# Altium schematic sheet 33.SchDoc
size 513 x 386 mm
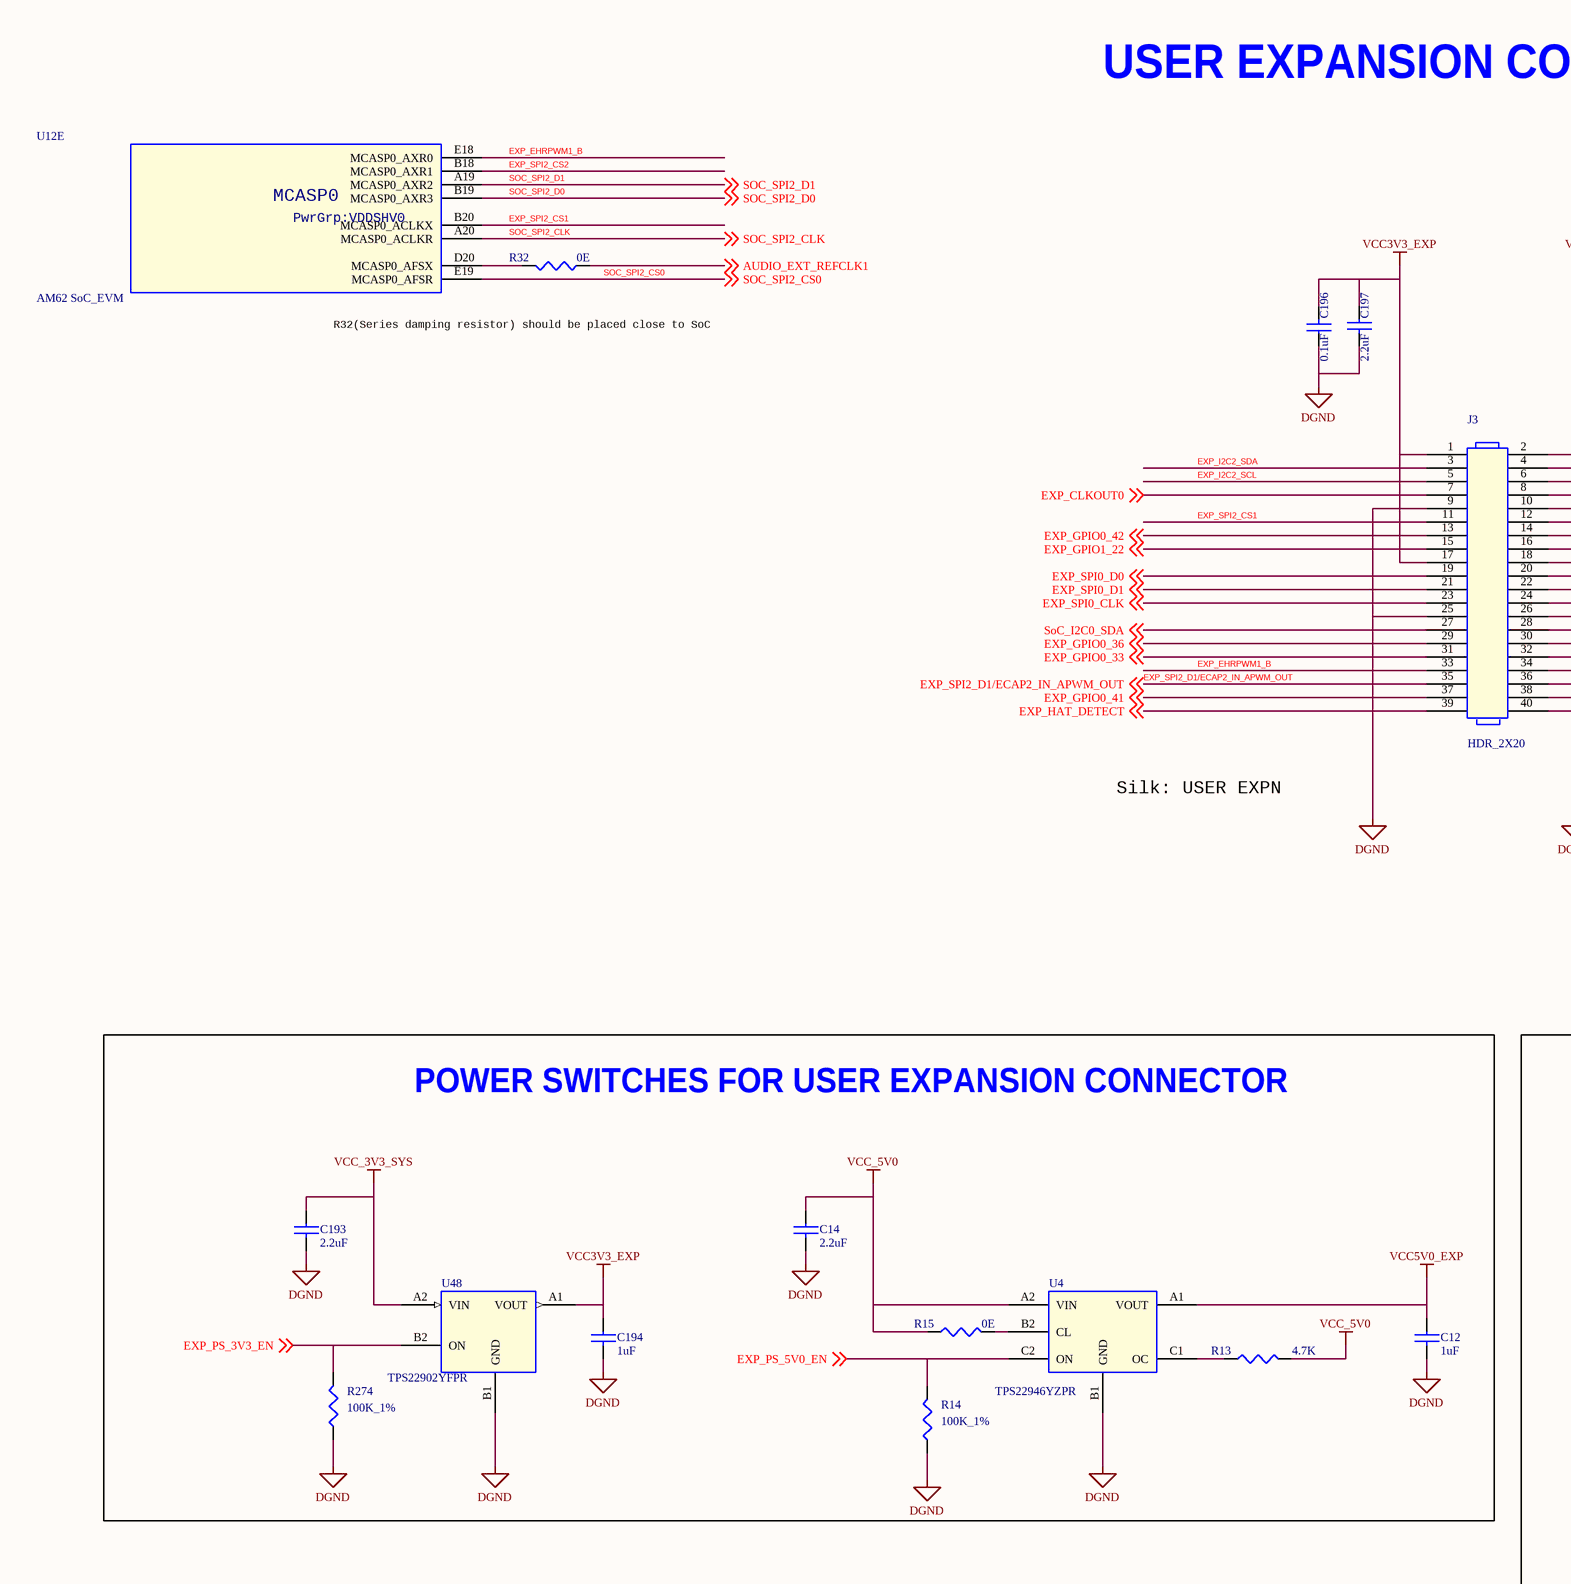
[diagram p0: 33.SchDoc, top left]
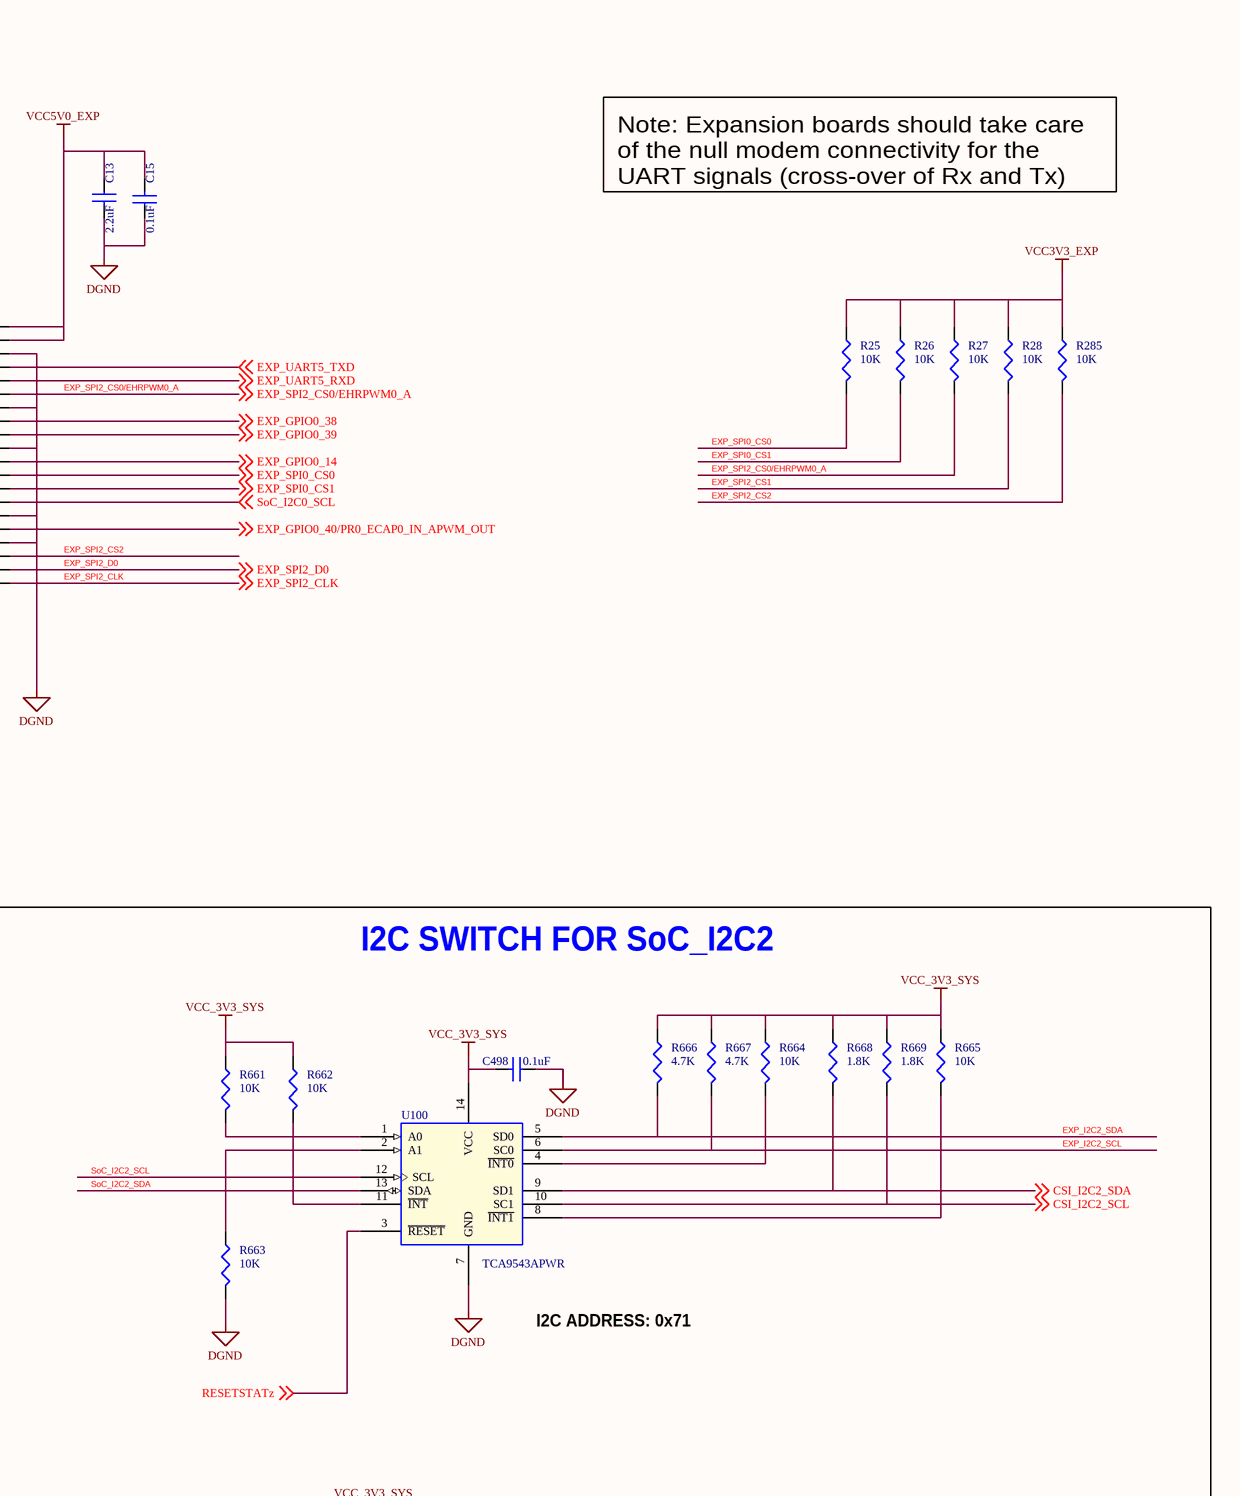
[diagram p1: 33.SchDoc, top right]
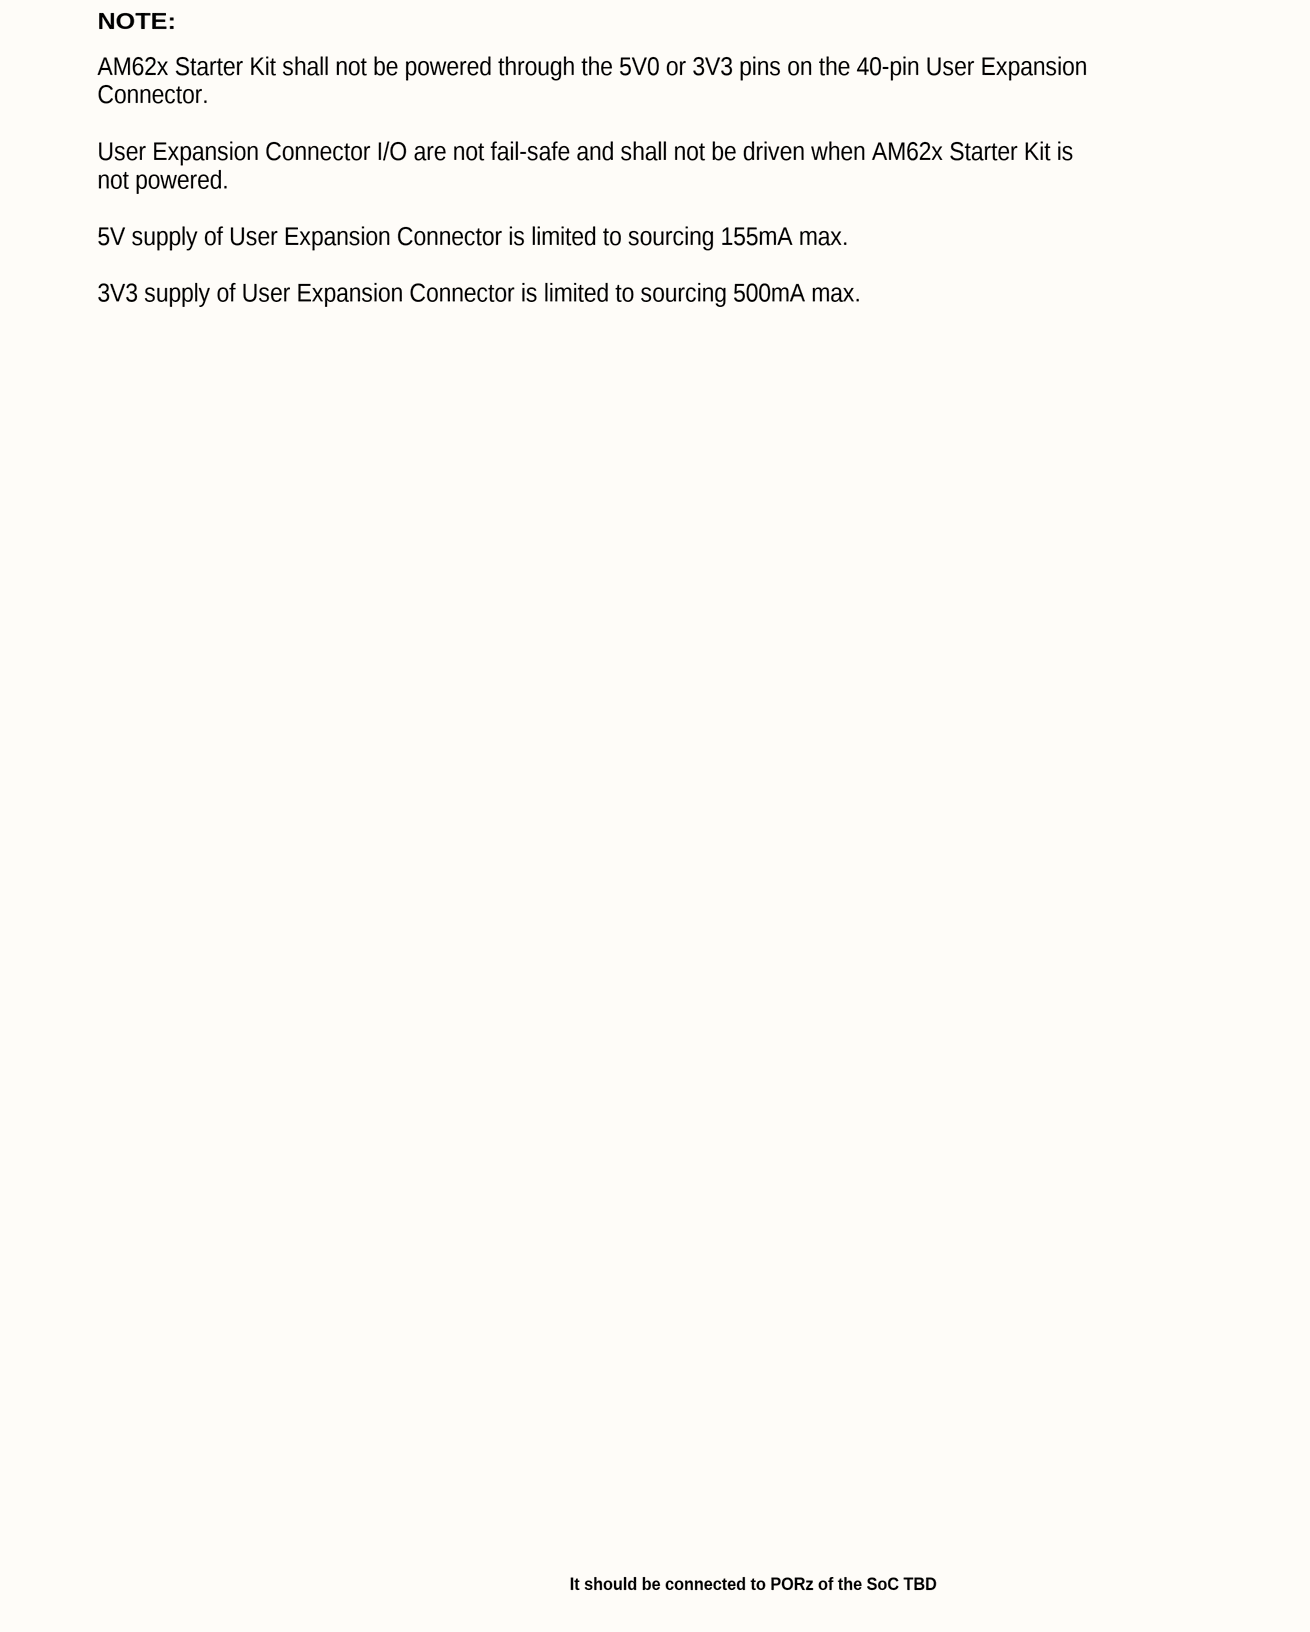
[diagram p2: 33.SchDoc, bottom left]
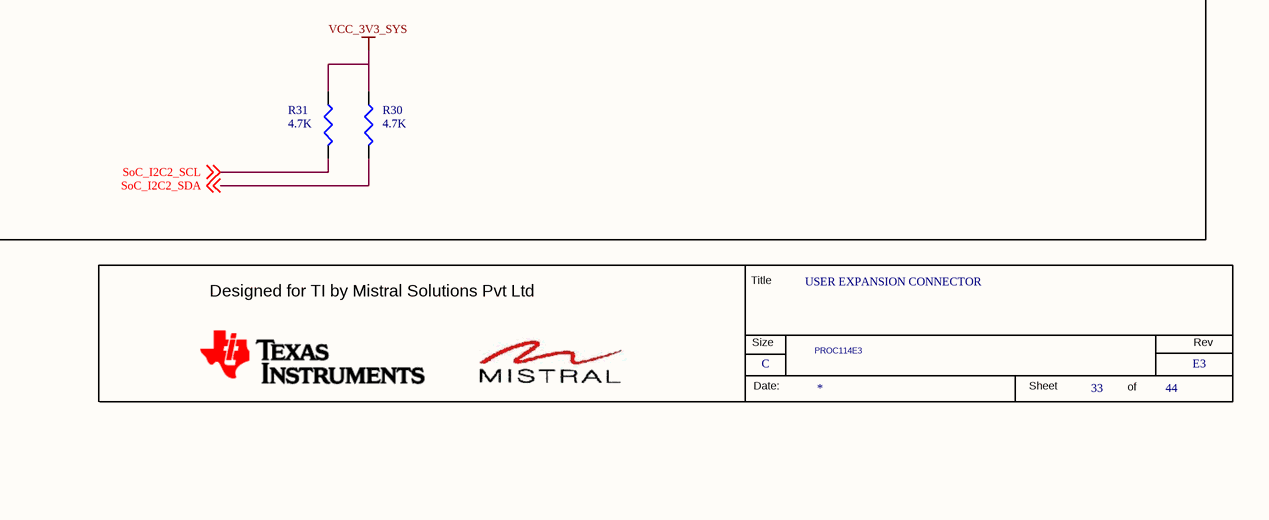
[diagram p3: 33.SchDoc, bottom right]

## Parts
*  RevCode: E3  Title: USER EXPANSION CONNECTOR  Page Size: C  Page Number: 33  Page Count: 44  Variant Name: PROC114E3  (hidden comment: MISTRAL_TITLEBLK_CSIZE)  (graphical)
C12  1uF  [CAP0201_0-5]
C13  2.2uF  [CAP0402_0-75]
C14  2.2uF  [CAP0402_0-75]
C15  0.1uF  [CAP0402_0-75]
C193  2.2uF  [CAP0402_0-75]
C194  1uF  [CAP0201_0-5]
C196  0.1uF  [CAP0402_0-75]
C197  2.2uF  [CAP0402_0-75]
C498  0.1uF  [CAP0402_0-75]
J3  HDR_2X20  [HDR_2X20_PEC20DAAN_S_T_8-6]
R13  4.7K  [RES0201_0-5]
R14  100K_1%  [RES0201_0-5]
R15  0E  [RES0201_0-5]
R25  10K  [RES0201_0-5]
R26  10K  [RES0201_0-5]
R27  10K  [RES0201_0-5]
R28  10K  [RES0201_0-5]
R30  4.7K  [RES0201_0-5]
R31  4.7K  [RES0201_0-5]
R32  0E  [RES0201_0-5]
R274  100K_1%  [RES0201_0-5]
R285  10K  [RES0201_0-5]
R661  10K  [RES0201_0-5]
R662  10K  [RES0201_0-5]
R663  10K  [RES0201_0-5]
R664  10K  [RES0201_0-5]
R665  10K  [RES0201_0-5]
R666  4.7K  [RES0201_0-5]
R667  4.7K  [RES0201_0-5]
R668  1.8K  [RES0201_0-5]
R669  1.8K  [RES0201_0-5]
U4  TPS22946YZPR  [DSBGA6_19-68_40X60_0-5]
U12  AM62 SoC_EVM  [BGA425_19-68_510X510_0-7]  (part E of 18)
U48  TPS22902YFPR  [DSBGA4_15-74_30X30_0-5]
U100  TCA9543APWR  [TSSOP14_25-59_205X180_1-2]

## Blocks framed on the sheet
POWER SWITCHES FOR USER EXPANSION CONNECTOR: C12 C14 C193 C194 R13-R15 R274 U4 U48
I2C SWITCH FOR SoC_I2C2: C498 R30 R31 R661-R669 U100

## Nets
DGND: C12.2 C13.2 C14.2 C15.1 C193.2 C194.2 C196.1 C197.2 C498.1 J3.6 J3.9 J3.14 J3.20 J3.25 J3.30 J3.34 R14.1 R274.1 R663.2 U4.B1(GND) U48.B1(GND) U100.7(GND)
VCC3V3_EXP: C194.1 C196.2 C197.1 J3.1 J3.17 R25.1 R26.1 R27.1 R28.1 R285.1 U48.A1(VOUT)
VCC5V0_EXP: C12.1 C13.1 C15.2 J3.2 J3.4 U4.A1(VOUT)
VCC_3V3_SYS: C193.1 C498.2 R30.1 R31.1 R661.1 R662.1 R664.1 R665.1 R666.1 R667.1 R668.1 R669.1 U48.A2(VIN) U100.14(VCC)
VCC_5V0: C14.1 R13.2 R15.1 U4.A2(VIN)
AUDIO_EXT_REFCLK1: R32.1 ; off-sheet AUDIO_EXT_REFCLK1
CSI_I2C2_SCL: R669.2 U100.10(SC1) ; off-sheet CSI_I2C2_SCL
CSI_I2C2_SDA: R668.2 U100.9(SD1) ; off-sheet CSI_I2C2_SDA
EXP_CLKOUT0: J3.7 ; off-sheet EXP_CLKOUT0
EXP_EHRPWM1_B: J3.33 U12.E18(MCASP0_AXR0)
EXP_GPIO0_14: J3.22 ; off-sheet EXP_GPIO0_14
EXP_GPIO0_33: J3.31 ; off-sheet EXP_GPIO0_33
EXP_GPIO0_36: J3.29 ; off-sheet EXP_GPIO0_36
EXP_GPIO0_38: J3.16 ; off-sheet EXP_GPIO0_38
EXP_GPIO0_39: J3.18 ; off-sheet EXP_GPIO0_39
EXP_GPIO0_40/PR0_ECAP0_IN_APWM_OUT: J3.32 ; off-sheet EXP_GPIO0_40/PR0_ECAP0_IN_APWM_OUT
EXP_GPIO0_41: J3.37 ; off-sheet EXP_GPIO0_41
EXP_GPIO0_42: J3.13 ; off-sheet EXP_GPIO0_42
EXP_GPIO1_22: J3.15 ; off-sheet EXP_GPIO1_22
EXP_HAT_DETECT: J3.39 ; off-sheet EXP_HAT_DETECT
EXP_I2C2_SCL: J3.5 R667.2 U100.6(SC0)
EXP_I2C2_SDA: J3.3 R666.2 U100.5(SD0)
EXP_PS_3V3_EN: R274.2 U48.B2(ON) ; off-sheet EXP_PS_3V3_EN
EXP_PS_5V0_EN: R14.2 U4.C2(ON) ; off-sheet EXP_PS_5V0_EN
EXP_SPI0_CLK: J3.23 ; off-sheet EXP_SPI0_CLK
EXP_SPI0_CS0: J3.24 R25.2 ; off-sheet EXP_SPI0_CS0
EXP_SPI0_CS1: J3.26 R26.2 ; off-sheet EXP_SPI0_CS1
EXP_SPI0_D0: J3.19 ; off-sheet EXP_SPI0_D0
EXP_SPI0_D1: J3.21 ; off-sheet EXP_SPI0_D1
EXP_SPI2_CLK: J3.40 ; off-sheet EXP_SPI2_CLK
EXP_SPI2_CS0/EHRPWM0_A: J3.12 R27.2 ; off-sheet EXP_SPI2_CS0/EHRPWM0_A
EXP_SPI2_CS1: J3.11 R28.2 U12.B20(MCASP0_ACLKX)
EXP_SPI2_CS2: J3.36 R285.2 U12.B18(MCASP0_AXR1)
EXP_SPI2_D0: J3.38 ; off-sheet EXP_SPI2_D0
EXP_SPI2_D1/ECAP2_IN_APWM_OUT: J3.35 ; off-sheet EXP_SPI2_D1/ECAP2_IN_APWM_OUT
EXP_UART5_RXD: J3.10 ; off-sheet EXP_UART5_RXD
EXP_UART5_TXD: J3.8 ; off-sheet EXP_UART5_TXD
RESETSTATz: U100.3(~{RESET}) ; off-sheet RESETSTATz
SoC_I2C0_SCL: J3.28 ; off-sheet SoC_I2C0_SCL
SoC_I2C0_SDA: J3.27 ; off-sheet SoC_I2C0_SDA
SoC_I2C2_SCL: R31.2 U100.12(SCL) ; off-sheet SoC_I2C2_SCL
SoC_I2C2_SDA: R30.2 U100.13(SDA) ; off-sheet SoC_I2C2_SDA
SOC_SPI2_CLK: U12.A20(MCASP0_ACLKR) ; off-sheet SOC_SPI2_CLK
SOC_SPI2_CS0: U12.E19(MCASP0_AFSR) ; off-sheet SOC_SPI2_CS0
SOC_SPI2_D0: U12.B19(MCASP0_AXR3) ; off-sheet SOC_SPI2_D0
SOC_SPI2_D1: U12.A19(MCASP0_AXR2) ; off-sheet SOC_SPI2_D1
NetR13_1: R13.1 U4.C1(OC)
NetR15_2: R15.2 U4.B2(CL)
NetR32_2: R32.2 U12.D20(MCASP0_AFSX)
NetR661_2: R661.2 U100.1(A0)
NetR662_2: R662.2 U100.11(~{INT})
NetR663_1: R663.1 U100.2(A1)
NetR664_2: R664.2 U100.4(~{INT0})
NetR665_2: R665.2 U100.8(~{INT1})

## Notes on the sheet
- USER EXPANSION CONNECTOR
- Note: Expansion boards should take care
  of the null modem connectivity for the
  UART signals (cross-over of Rx and Tx)
- R32(Series damping resistor) should be placed close to SoC
- Silk: USER EXPN
- I2C ADDRESS: 0x71
- NOTE:
- AM62x Starter Kit shall not be powered through the 5V0 or 3V3 pins on the 40-pin User Expansion
  Connector.
  User Expansion Connector I/O are not fail-safe and shall not be driven when AM62x Starter Kit is
  not powered.
  5V supply of User Expansion Connector is limited to sourcing 155mA max.
  3V3 supply of User Expansion Connector is limited to sourcing 500mA max.
- It should be connected to PORz of the SoC TBD
- (in symbol AM62-EVM_BGA425, part E) MCASP0; PwrGrp:VDDSHV0
- (in symbol MISTRAL_TITLEBLK_CSIZE) Title; Designed for TI by Mistral Solutions Pvt Ltd; Size; Rev; Date:; Sheet; of

## Library data of the parts
* = MISTRAL_TITLEBLK_CSIZE: Issue: 1.0; Page Create Date: March  8, 1995; Page Modify Date: *; Schematic Page Count: 44; Schematic Page Number: 33
C12 = CAP_Dup2: CAP CERAMIC 1uF 16V 20% X5R 0201; Mistral Part No: 120018090038-R; Mfr_name: MURATA; Mfr_part_number: GRM033R61C105ME15D; Part_type: CAPACITORS\CERAMIC; Project: QCS610_NANOSOM; Wattage: NA; Customs_HS_Code: 85322990; Custom_Duty: 15%; PCB Footprint: CAP0201_0-5; Library Ref: CAP; MECHANICAL 3D STEP FILE: CAP0201_0-5; Tolerance: 20%; Voltage: 16V; Package: 0201; Distributor_name: DIGIKEY; Distributor_part_number: 490-18654-1-ND; Height: 0.39MM; Weight: 0.33mg; Temperature: -55°C+85°C; Datasheet: Y:\MIS_DATABASE\DATASHEETS\CAPACITORS\GRM033R61C105ME15.PDF; Crtd /date: ALVY/260520; Chkd/date: MANIRAJA/300520; Footprint Ref: CAP0201_0-5; Library Path: Y:\MIS_DATABASE\Library\ALTIUM_TOOL\SCHEMATICS_PARTS\MS_DISCRETE_Library.schlib; Footprint Path: Y:\MIS_DATABASE\Library\ALTIUM_TOOL\PCB_FOOTPRINTS\Altium_Footprint_Lib.PcbLib
C13 C197 = CAP: CAP CERAMIC 2.2uF 25V 10% X5R 0402; Mistral Part No: 120015120001-R; Mfr_name: MURATA; Mfr_part_number: GRM155R61E225KE11D; Part_type: CAPACITORS\CERAMIC; Project: TI_AM263X_CC; Wattage: NA; Customs_HS_Code: 85322990; Custom_Duty: 15%; PCB Footprint: CAP0402_0-75; Footprint Ref: CAP0402_0-75; Tolerance: 10%; Voltage: 25V; Package: 0402; Distributor_name: DIGIKEY; Distributor_part_number: 490-12703-1-ND; Library Ref: CAP; Height: 0.70MM; Weight: 1.5mg; Temperature: -55°C+85°C; Datasheet: Y:\MIS_DATABASE\DATASHEETS\CAPACITORS\GRM155R61E225KE11.PDF; Crtd /date: MANIRAJA/010721; Chkd/date: ALVY/010721; MECHANICAL 3D STEP FILE: CAP0402_0-75; Library Path: Y:\MIS_DATABASE\Library\ALTIUM_TOOL\SCHEMATICS_PARTS\MS_DISCRETE_Library.schlib; Footprint Path: Y:\MIS_DATABASE\Library\ALTIUM_TOOL\PCB_FOOTPRINTS\Altium_Footprint_Lib.PcbLib
C14 C193 = CAP: CAP CERAMIC 2.2uF 25V 10% X5R 0402; Part_type: CAPACITORS\CERAMIC; Mfr_part_number: GRM155R61E225KE11D; Mfr_name: MURATA; Mistral Part No: 120015120001-R; Custom_Duty: 15%; Customs_HS_Code: 85322990; Wattage: NA; Project: TI_AM263X_CC; PCB Footprint: CAP0402_0-75; Footprint Path: Y:\MIS_DATABASE\Library\ALTIUM_TOOL\PCB_FOOTPRINTS\Altium_Footprint_Lib.PcbLib; Library Path: Y:\MIS_DATABASE\Library\ALTIUM_TOOL\SCHEMATICS_PARTS\MS_DISCRETE_Library.schlib; MECHANICAL 3D STEP FILE: CAP0402_0-75; Chkd/date: ALVY/010721; Crtd /date: MANIRAJA/010721; Datasheet: Y:\MIS_DATABASE\DATASHEETS\CAPACITORS\GRM155R61E225KE11.PDF; Temperature: -55°C+85°C; Weight: 1.5mg; Height: 0.70MM; Library Ref: CAP; Distributor_part_number: 490-12703-1-ND; Distributor_name: DIGIKEY; Package: 0402; Voltage: 25V; Tolerance: 10%; Footprint Ref: CAP0402_0-75
C15 C196 C498 = CAP_Dup2: CAP CERAMIC 0.1uF 50V 10% X7R 0402; Alt_Mfr_part_number: CC0402KRX5R8BB104; Mistral Part No: 120011100014-R; Mfr_name: MURATA; Mfr_part_number: GRM155R71H104KE14D; Part_type: CAPACITORS\CERAMIC; Alt_Mfr_name: YAGEO AMERICA; Project: J7_CP; Wattage: NA; Customs_HS_Code: 85322990; Custom_Duty: 15%; PCB Footprint: CAP0402_0-75; Tolerance: 10%; Voltage: 50V; Package: 0402; Distributor_name: DIGIKEY; Distributor_part_number: 490-10700-1-ND; Height: 0.55MM; Weight: 3.1mg; Temperature: -55°C+125°C; Datasheet: Y:\MIS_DATABASE\DATASHEETS\CAPACITORS\GRM155R71H104KE14.PDF; Crtd /date: ALVY/211020; Chkd/date: MANIRAJA/261020; MECHANICAL 3D STEP FILE: CAP0402_0-75; Library Ref: CAP; Footprint Ref: CAP0402_0-75; Library Path: Y:\MIS_DATABASE\Library\ALTIUM_TOOL\SCHEMATICS_PARTS\MS_DISCRETE_Library.schlib; Footprint Path: Y:\MIS_DATABASE\Library\ALTIUM_TOOL\PCB_FOOTPRINTS\Altium_Footprint_Lib.PcbLib
C194 = CAP_Dup2: CAP CERAMIC 1uF 16V 20% X5R 0201; Part_type: CAPACITORS\CERAMIC; Mfr_part_number: GRM033R61C105ME15D; Mfr_name: MURATA; Mistral Part No: 120018090038-R; Custom_Duty: 15%; Customs_HS_Code: 85322990; Wattage: NA; Project: QCS610_NANOSOM; PCB Footprint: CAP0201_0-5; Footprint Path: Y:\MIS_DATABASE\Library\ALTIUM_TOOL\PCB_FOOTPRINTS\Altium_Footprint_Lib.PcbLib; Library Path: Y:\MIS_DATABASE\Library\ALTIUM_TOOL\SCHEMATICS_PARTS\MS_DISCRETE_Library.schlib; Footprint Ref: CAP0201_0-5; Chkd/date: MANIRAJA/300520; Crtd /date: ALVY/260520; Datasheet: Y:\MIS_DATABASE\DATASHEETS\CAPACITORS\GRM033R61C105ME15.PDF; Temperature: -55°C+85°C; Weight: 0.33mg; Height: 0.39MM; Distributor_part_number: 490-18654-1-ND; Distributor_name: DIGIKEY; Package: 0201; Voltage: 16V; Tolerance: 20%; MECHANICAL 3D STEP FILE: CAP0201_0-5; Library Ref: CAP
J3 = HEADER_20X2: CON HDR 2X20 2.54MM PITCH ST TH; Part_type: CONNECTOR\HEADERS; Mfr_part_number: PEC20DAAN; Mfr_name: SULLINS CONNECTOR; Mistral Part No: 150020100013-R; Custom_Duty: 24%; Customs_HS_Code: 85369090; Wattage: NA; Project: AM64X_SKEVM; PCB Footprint: HDR_2X20_PEC20DAAN_S_T_8-6; Footprint Path: Y:\MIS_DATABASE\Library\ALTIUM_TOOL\PCB_FOOTPRINTS\Altium_Footprint_Lib.PcbLib; Library Path: Y:\MIS_DATABASE\Library\ALTIUM_TOOL\SCHEMATICS_PARTS\MS_CONNECTOR_Library.schlib; MECHANICAL 3D STEP FILE: HDR_2X20_PEC20DAAN_S_T_8-6; Chkd/date: MANIRAJA/261020; Crtd /date: MANIRAJA/261020; Datasheet: Y:\MIS_DATABASE\DATASHEETS\CONNECTORS\XXCXXDXXN.PDF; Temperature: -65°C+125°C; Weight: NA; Height: 8.58MM; Footprint Ref: HDR_2X20_PEC20DAAN_S_T_8-6; Library Ref: HEADER_20X2; Distributor_part_number: S2012E-20-ND; Distributor_name: DIGIKEY; Package: THRU-HOLE; Voltage: NA; Tolerance: NA
R13 R31 R666 R667 = RESISTOR_Dup6: RES 4.7K 1/20W 5% 0201; Part_type: RESISTORS\FIXED; Mfr_part_number: RC0201JR-074K7L; Mfr_name: YAGEO AMERICA; Mistral Part No: 110021090007-R; Custom_Duty: 15%; Customs_HS_Code: 85332119; Voltage: NA; Project: TI_AM62x SKEVM_BRD; PCB Footprint: RES0201_0-5; Footprint Path: Y:\MIS_DATABASE\Library\ALTIUM_TOOL\PCB_FOOTPRINTS\Altium_Footprint_Lib.PcbLib; Library Path: Y:\MIS_DATABASE\Library\ALTIUM_TOOL\SCHEMATICS_PARTS\MS_DISCRETE_Library.schlib; MECHANICAL 3D STEP FILE: RES0201_0-5; Chkd/date: MANIRAJA/200921; Crtd /date: ALVY/200921; Datasheet: Y:\MIS_DATABASE\DATASHEETS\RESISTORS\RCXXXXL-SER_MAR18.PDF; Temperature: -55°C+125°C; Weight: 0.17mg; Height: 0.26MM; Library Ref: RESISTOR; Distributor_part_number: 311-4.7KNCT-ND; Distributor_name: DIGIKEY; Package: 0201; Wattage: 1/20W; Tolerance: 5%; Footprint Ref: RES0201_0-5
R14 R274 = RESISTOR_Dup6: RES 100K 1/20W 1% 0201; Mistral Part No: 110009060005-R; Mfr_name: YAGEO AMERICA; Mfr_part_number: RC0201FR-07100KL; Part_type: RESISTORS\FIXED; Project: SD865_NANOSOM; Voltage: NA; Customs_HS_Code: 85332119; Custom_Duty: 15%; PCB Footprint: RES0201_0-5; Footprint Ref: RES0201_0-5; Tolerance: 1%; Wattage: 1/20W; Package: 0201; Distributor_name: DIGIKEY; Distributor_part_number: 311-100KMCT-ND; Library Ref: RESISTOR; Height: 0.26MM; Weight: 9mg; Temperature: -55°C+125°C; Datasheet: Y:\MIS_DATABASE\DATASHEETS\RESISTORS\RCXXXXL-SER_MAR18.PDF; Crtd /date: ALVY/120520; Chkd/date: MANIRAJA/120520; MECHANICAL 3D STEP FILE: RES0201_0-5; Library Path: Y:\MIS_DATABASE\Library\ALTIUM_TOOL\SCHEMATICS_PARTS\MS_DISCRETE_Library.schlib; Footprint Path: Y:\MIS_DATABASE\Library\ALTIUM_TOOL\PCB_FOOTPRINTS\Altium_Footprint_Lib.PcbLib
R15 = RESISTOR_Dup1: RES 0E 1/20W 5% 0201; Mistral Part No: 110010070067-R; Mfr_name: YAGEO AMERICA; Mfr_part_number: RC0201JR-070RL; Part_type: RESISTORS\FIXED; Project: PB_BUGBASE; Voltage: NA; Customs_HS_Code: 85332119; Custom_Duty: 15%; PCB Footprint: RES0201_0-5; Tolerance: 5%; Wattage: 1/20W; Package: 0201; Distributor_name: DIGIKEY; Distributor_part_number: 311-0.0NCT-ND; Height: 0.26MM; Weight: 0.17mg; Temperature: -55°C+125°C; Datasheet: Y:\MIS_DATABASE\DATASHEETS\RESISTORS\RCXXXXL-SER_MAR18.PDF; Crtd /date: MUDDU/120710; Chkd/date: NAVEED/301214; MECHANICAL 3D STEP FILE: RES0201_0-5; Library Ref: RESISTOR; Footprint Ref: RES0201_0-5; Library Path: Y:\MIS_DATABASE\Library\ALTIUM_TOOL\SCHEMATICS_PARTS\MS_DISCRETE_Library.schlib; Footprint Path: Y:\MIS_DATABASE\Library\ALTIUM_TOOL\PCB_FOOTPRINTS\Altium_Footprint_Lib.PcbLib
R25-R28 R285 R665 = RESISTOR_Dup6: RES 10K 1/20W 5% 0201; Part_type: RESISTORS\FIXED; Mfr_part_number: RC0201JR-0710KL; Mfr_name: YAGEO AMERICA; Mistral Part No: 110010070051-R; Custom_Duty: 15%; Customs_HS_Code: 85332119; Voltage: NA; Project: GOLDEN-I LITE; PCB Footprint: RES0201_0-5; Footprint Path: Y:\MIS_DATABASE\Library\ALTIUM_TOOL\PCB_FOOTPRINTS\Altium_Footprint_Lib.PcbLib; Library Path: Y:\MIS_DATABASE\Library\ALTIUM_TOOL\SCHEMATICS_PARTS\MS_DISCRETE_Library.schlib; MECHANICAL 3D STEP FILE: RES0201_0-5; Chkd/date: MANIRAJA/050517; Crtd /date: MANIRAJA/050517; Datasheet: Y:\MIS_DATABASE\DATASHEETS\RESISTORS\RCXXXXL-SER_MAR18.PDF; Temperature: -55°C+125°C; Weight: 0.17mg; Height: 0.26MM; Library Ref: RESISTOR; Distributor_part_number: 311-10KNCT-ND; Distributor_name: DIGIKEY; Package: 0201; Wattage: 1/20W; Tolerance: 5%; Footprint Ref: RES0201_0-5
R30 = RESISTOR_Dup6: RES 4.7K 1/20W 5% 0201; Mistral Part No: 110021090007-R; Mfr_name: YAGEO AMERICA; Mfr_part_number: RC0201JR-074K7L; Part_type: RESISTORS\FIXED; Project: TI_AM62x SKEVM_BRD; Voltage: NA; Customs_HS_Code: 85332119; Custom_Duty: 15%; PCB Footprint: RES0201_0-5; Footprint Ref: RES0201_0-5; Tolerance: 5%; Wattage: 1/20W; Package: 0201; Distributor_name: DIGIKEY; Distributor_part_number: 311-4.7KNCT-ND; Library Ref: RESISTOR; Height: 0.26MM; Weight: 0.17mg; Temperature: -55°C+125°C; Datasheet: Y:\MIS_DATABASE\DATASHEETS\RESISTORS\RCXXXXL-SER_MAR18.PDF; Crtd /date: ALVY/200921; Chkd/date: MANIRAJA/200921; MECHANICAL 3D STEP FILE: RES0201_0-5; Library Path: Y:\MIS_DATABASE\Library\ALTIUM_TOOL\SCHEMATICS_PARTS\MS_DISCRETE_Library.schlib; Footprint Path: Y:\MIS_DATABASE\Library\ALTIUM_TOOL\PCB_FOOTPRINTS\Altium_Footprint_Lib.PcbLib
R32 = RESISTOR_Dup1: RES 0E 1/20W 5% 0201; Part_type: RESISTORS\FIXED; Mfr_part_number: RC0201JR-070RL; Mfr_name: YAGEO AMERICA; Mistral Part No: 110010070067-R; Custom_Duty: 15%; Customs_HS_Code: 85332119; Voltage: NA; Project: PB_BUGBASE; PCB Footprint: RES0201_0-5; Footprint Path: Y:\MIS_DATABASE\Library\ALTIUM_TOOL\PCB_FOOTPRINTS\Altium_Footprint_Lib.PcbLib; Library Path: Y:\MIS_DATABASE\Library\ALTIUM_TOOL\SCHEMATICS_PARTS\MS_DISCRETE_Library.schlib; MECHANICAL 3D STEP FILE: RES0201_0-5; Chkd/date: NAVEED/301214; Crtd /date: MUDDU/120710; Datasheet: Y:\MIS_DATABASE\DATASHEETS\RESISTORS\RCXXXXL-SER_MAR18.PDF; Temperature: -55°C+125°C; Weight: 0.17mg; Height: 0.26MM; Footprint Ref: RES0201_0-5; Library Ref: RESISTOR; Distributor_part_number: 311-0.0NCT-ND; Distributor_name: DIGIKEY; Package: 0201; Wattage: 1/20W; Tolerance: 5%
R661-R664 = RESISTOR_Dup6: RES 10K 1/20W 5% 0201; Mistral Part No: 110010070051-R; Mfr_name: YAGEO AMERICA; Mfr_part_number: RC0201JR-0710KL; Part_type: RESISTORS\FIXED; Project: GOLDEN-I LITE; Voltage: NA; Customs_HS_Code: 85332119; Custom_Duty: 15%; PCB Footprint: RES0201_0-5; Footprint Ref: RES0201_0-5; Tolerance: 5%; Wattage: 1/20W; Package: 0201; Distributor_name: DIGIKEY; Distributor_part_number: 311-10KNCT-ND; Library Ref: RESISTOR; Height: 0.26MM; Weight: 0.17mg; Temperature: -55°C+125°C; Datasheet: Y:\MIS_DATABASE\DATASHEETS\RESISTORS\RCXXXXL-SER_MAR18.PDF; Crtd /date: MANIRAJA/050517; Chkd/date: MANIRAJA/050517; MECHANICAL 3D STEP FILE: RES0201_0-5; Library Path: Y:\MIS_DATABASE\Library\ALTIUM_TOOL\SCHEMATICS_PARTS\MS_DISCRETE_Library.schlib; Footprint Path: Y:\MIS_DATABASE\Library\ALTIUM_TOOL\PCB_FOOTPRINTS\Altium_Footprint_Lib.PcbLib
R668 = RESISTOR_Dup6: RES 1.8K 1/20W 5% 0201; Manufacturer: PANASONIC-ECG; Mistral Part No: 110022040002-R; Mfr_part_number: ERJ-1GNJ182C; Part_type: RESISTORS\FIXED; Project: TI_AM62x_SKEVM_BRD; Voltage: NA; Customs_HS_Code: 85332119; Custom_Duty: 15%; PCB Footprint: RES0201_0-5; Footprint Ref: RES0201_0-5; Mfr_name: PANASONIC-ECG; Tolerance: 5%; Wattage: 1/20W; Package: 0201; Distributor_name: DIGIKEY; Distributor_part_number: P123258CT-ND; Library Ref: RESISTOR; Height: 0.26MM; Weight: 0.15mg; Temperature: -55°C+125°C; Datasheet: Y:\MIS_DATABASE\DATASHEETS\RESISTORS\PAN-ERJSER_NOV17.PDF; Crtd /date: TAMILARASU/070422; Chkd/date: ALVY/070422; MECHANICAL 3D STEP FILE: RES0201_0-5; Library Path: Y:\MIS_DATABASE\Library\ALTIUM_TOOL\SCHEMATICS_PARTS\MS_DISCRETE_Library.schlib; Footprint Path: Y:\MIS_DATABASE\Library\ALTIUM_TOOL\PCB_FOOTPRINTS\Altium_Footprint_Lib.PcbLib
R669 = RESISTOR_Dup6: RES 1.8K 1/20W 5% 0201; Manufacturer: PANASONIC-ECG; Part_type: RESISTORS\FIXED; Mfr_part_number: ERJ-1GNJ182C; Mistral Part No: 110022040002-R; Custom_Duty: 15%; Customs_HS_Code: 85332119; Voltage: NA; Project: TI_AM62x_SKEVM_BRD; PCB Footprint: RES0201_0-5; Footprint Path: Y:\MIS_DATABASE\Library\ALTIUM_TOOL\PCB_FOOTPRINTS\Altium_Footprint_Lib.PcbLib; Library Path: Y:\MIS_DATABASE\Library\ALTIUM_TOOL\SCHEMATICS_PARTS\MS_DISCRETE_Library.schlib; MECHANICAL 3D STEP FILE: RES0201_0-5; Chkd/date: ALVY/070422; Crtd /date: TAMILARASU/070422; Datasheet: Y:\MIS_DATABASE\DATASHEETS\RESISTORS\PAN-ERJSER_NOV17.PDF; Temperature: -55°C+125°C; Weight: 0.15mg; Height: 0.26MM; Library Ref: RESISTOR; Distributor_part_number: P123258CT-ND; Distributor_name: DIGIKEY; Package: 0201; Wattage: 1/20W; Tolerance: 5%; Mfr_name: PANASONIC-ECG; Footprint Ref: RES0201_0-5
U4 = TPS22946_DSBGA6: IC CURRENT-LIMITED LOAD SWITCH WITH SHUTOFF AUTO-RESTART AND OVERCURRENT CONDITION TIME-OUT DSBGA6; Part_type: ICS\POWER\MANAGEMENT; Mfr_name: TEXAS INSTRUMENTS; Mistral Part No: 142021010016-R; Custom_Duty: 15%; Customs_HS_Code: 85423100; Wattage: NA; Project: AM64X_SKEVM; PCB Footprint: DSBGA6_19-68_40X60_0-5; Footprint Path: Y:\MIS_DATABASE\Library\ALTIUM_TOOL\PCB_FOOTPRINTS\Altium_Footprint_Lib.PcbLib; Library Path: Y:\MIS_DATABASE\Library\ALTIUM_TOOL\SCHEMATICS_PARTS\MS_MISCPOWER_Library.schlib; MECHANICAL 3D STEP FILE: DSBGA6_19-68_40X60_0-5; Chkd/date: MANIRAJA/220121; Crtd /date: ALVY/220121; Datasheet: Y:\MIS_DATABASE\DATASHEETS\ICS\POWER\TPS22946.PDF; Temperature: -40°C+85°C; Weight: 1.7mg; Height: 0.50MM; Library Ref: TPS22946_DSBGA6; Distributor_part_number: 296-25219-1-ND; Distributor_name: DIGIKEY; Package: DSBGA6; Voltage: NA; Tolerance: NA; Mfr_part_number: TPS22946YZPR; Footprint Ref: DSBGA6_19-68_40X60_0-5
U12 = AM62-EVM_BGA425: IC AM62 SoC MICROPROCESSOR BGA425; Mistral Part No: 141221060001; Mfr_name: TEXAS INSTRUMENTS; Part_type: ICS\DIGITAL\MICROPROCESSOR; Project: AM62_EVM_BRD; Tolerance: NA; Customs_HS_Code: 85423100; Custom_Duty: 15%; PCB Footprint: BGA425_19-68_510X510_0-7; Mfr_part_number: AM62 SoC_EVM; Voltage: NA; Wattage: NA; Package: BGA425; Distributor_name: NA; Distributor_part_number: NA; Library Ref: AM62-EVM_BGA425; Footprint Ref: BGA425_19-68_510X510_0-7; Height: 0.65MM; Weight: NA; Temperature: NA; Datasheet: Y:\MIS_DATABASE\DATASHEETS\ICS\DIGITAL\MICROCONTROLLER\AM62-SoC_SVB.PDF; Crtd /date: MANIRAJA/110621; Chkd/date: ALVY/110621; RoHS: NA; MECHANICAL 3D STEP FILE: BGA425_19-68_510X510_0-7; Library Path: Y:\MIS_DATABASE\Library\ALTIUM_TOOL\SCHEMATICS_PARTS\MS_MICROPROCESSOR_Library.schlib; Footprint Path: Y:\MIS_DATABASE\Library\ALTIUM_TOOL\PCB_FOOTPRINTS\Altium_Footprint_Lib.PcbLib
U48 = TPS22912CYZVR_DSBGA4: IC 3.6V 500mA 78mE ON-RESISTANCE LOAD SWITCH WITH CONTROLLED TURNON DSBGA4; Part_type: ICS\POWER; Mfr_name: TEXAS INSTRUMENTS; Mistral Part No: 142020090007-R; Custom_Duty: 15%; Customs_HS_Code: 85423100; Wattage: NA; Project: AM64X_SKEVM; PCB Footprint: DSBGA4_15-74_30X30_0-5; Footprint Path: Y:\MIS_DATABASE\Library\ALTIUM_TOOL\PCB_FOOTPRINTS\Altium_Footprint_Lib.PcbLib; Library Path: Y:\MIS_DATABASE\Library\ALTIUM_TOOL\SCHEMATICS_PARTS\MS_MISCPOWER_Library.schlib; MECHANICAL 3D STEP FILE: DSBGA4_15-74_30X30_0-5; Chkd/date: MANIRAJA/170920; Crtd /date: ALVY/160920; Datasheet: Y:\MIS_DATABASE\DATASHEETS\ICS\POWER\TPS22901-2-3.PDF; Temperature: -40°C+85°C; Weight: 0.7mg; Height: 0.50MM; Library Ref: TPS22912CYZVR_DSBGA4; Distributor_part_number: 296-24472-1-ND; Distributor_name: DIGIKEY; Package: DSBGA4; Voltage: NA; Tolerance: NA; Mfr_part_number: TPS22902YFPR; Footprint Ref: DSBGA4_15-74_30X30_0-5
U100 = TCA9543APWR_TSSOP14: IC 2-CHANNEL I2C BUS SWITCH WITH INTERRUPT LOGIC AND RESET TSSOP14; Mistral Part No: 141016030006-R; Manufacturer: TEXAS INSTRUMENTS; Part_type: ICS\DIGITAL\BUSTRANSCEIVER; Project: OCTASIC_3600; Tolerance: NA; Customs_HS_Code: 85423100; Custom_Duty: 15%; PCB Footprint: TSSOP14_25-59_205X180_1-2; Footprint Ref: TSSOP14_25-59_205X180_1-2; Mfr_part_number: TCA9543APWR; Voltage: NA; Wattage: NA; Package: TSSOP14; Distributor_name: DIGIKEY; Distributor_part_number: 296-42157-1-ND; Library Ref: TCA9543APWR_TSSOP14; Height: 1.20MM; Weight: NA; Temperature: -40°C+85°C; Datasheet: Y:\MIS_DATABASE\DATASHEETS\ICS\DIGITAL\BUSTRANSCEIVER\TCA9543A.PDF; Crtd /date: VASANTHA/070316; Chkd/date: VASANTHA/060516; MECHANICAL 3D STEP FILE: TSSOP14_25-59_205X180_1-2; Library Path: Y:\MIS_DATABASE\Library\ALTIUM_TOOL\SCHEMATICS_PARTS\MS_BUSDRIVERTRANSCEIVER_Library.schlib; Footprint Path: Y:\MIS_DATABASE\Library\ALTIUM_TOOL\PCB_FOOTPRINTS\Altium_Footprint_Lib.PcbLib